# Altium project IMU module.PrjPcb
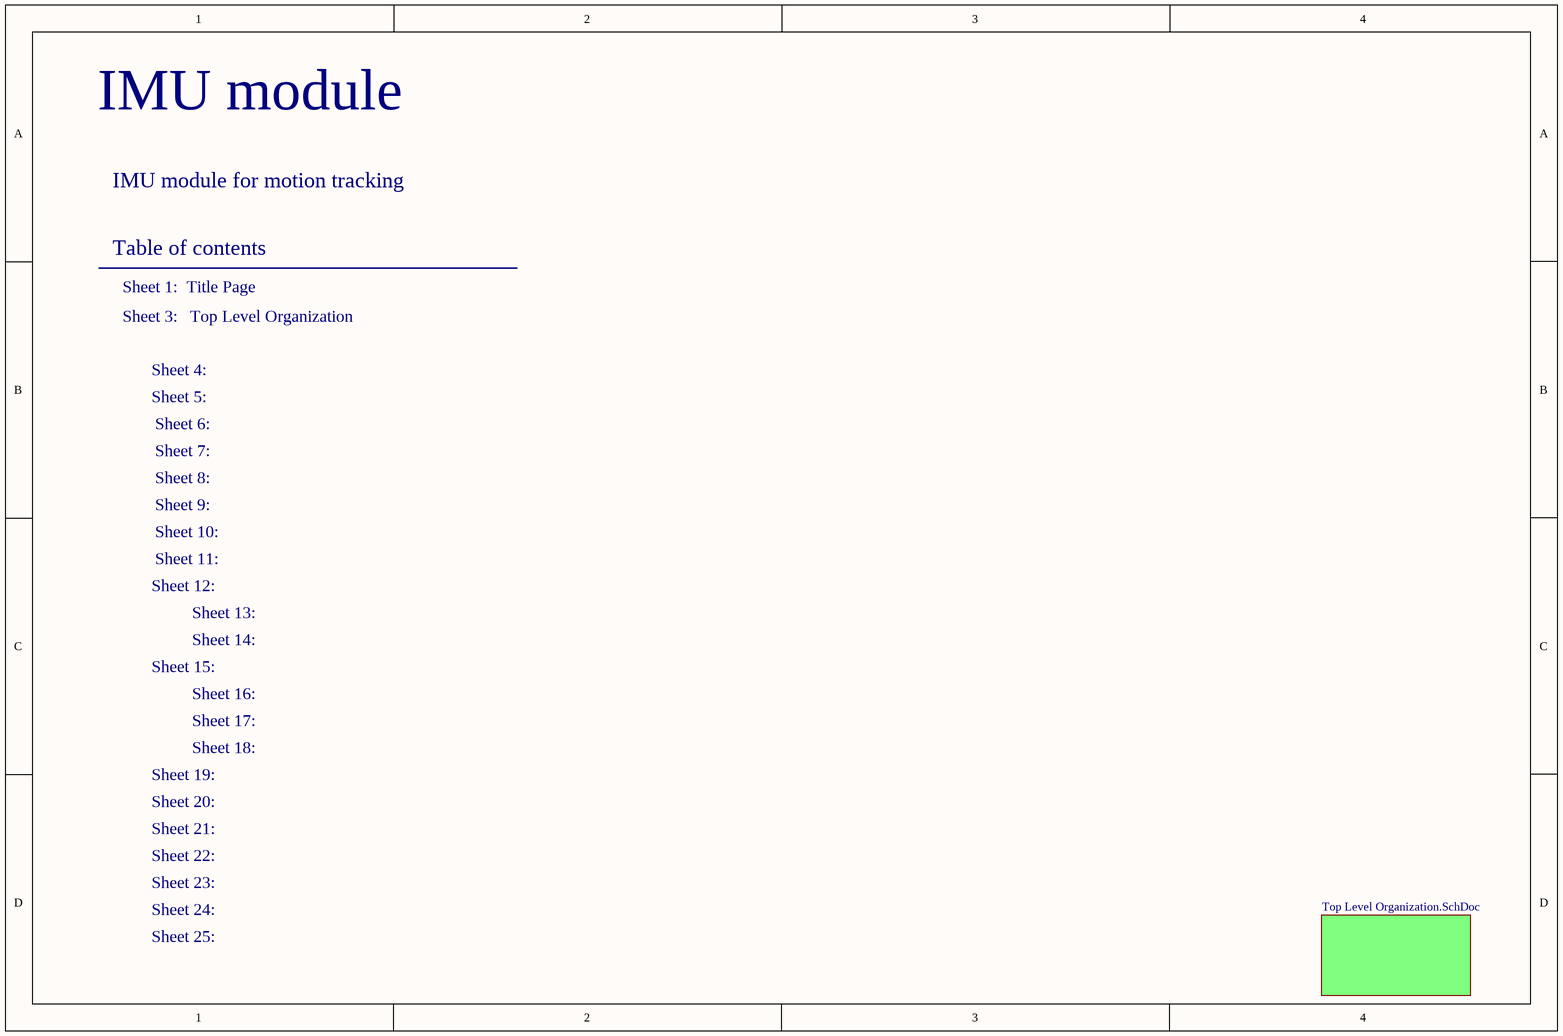
[diagram p0: Title Page.SchDoc]
1.Project Title: IMU module; 2.Title Page: Title Page; 3.Project Revision: A; 4.Drawn By: KS; 5.Description: IMU module for motion tracking; 6.Top Level Organization: Top Level Organization; 7.Title Schema 1: nRF; 8.Title Schema 2: IMU; 9.Title Schema 3: LDO; 10.Title Schema 4: BMS; 11.Title Schema 5: FUEL GAUGE; 12.Title Schema 6: MAG; 13.Title Schema 7: ANT
8 sheets, 55 parts. Net scope: flat (ports and power ports of the same name join across sheets).
Board file: PCB IMU module.PcbDoc
Sheets:
  Title Page.SchDoc
    Designator = Top Level Organization.SchDoc
      Designator = ESP.SchDoc
      Designator = IMU.SchDoc
      Designator = LDO.SchDoc
      Designator = BMS.SchDoc
      Designator = MAG.SchDoc
      Designator = CONNECTORS.SchDoc

## Sheet Title Page.SchDoc
size A4; SheetNumber: 1; SheetTotal: 1

### Sub-sheets
Designator = Top Level Organization.SchDoc: no entries

### Notes on the sheet
- Table of contents
- Sheet 1:
- Sheet 3:
- Sheet 4:
- Sheet 5:
- Sheet 6:
- Sheet 7:
- Sheet 8:
- Sheet 9:
- Sheet 10:
- Sheet 11:
- Sheet 12:
- Sheet 13:
- Sheet 14:
- Sheet 15:
- Sheet 16:
- Sheet 19:
- Sheet 17:
- Sheet 18:
- Sheet 20:
- Sheet 21:
- Sheet 22:
- Sheet 23:
- Sheet 24:
- Sheet 25:

## Sheet Top Level Organization.SchDoc
size A4; SheetNumber: 2; SheetTotal: 8
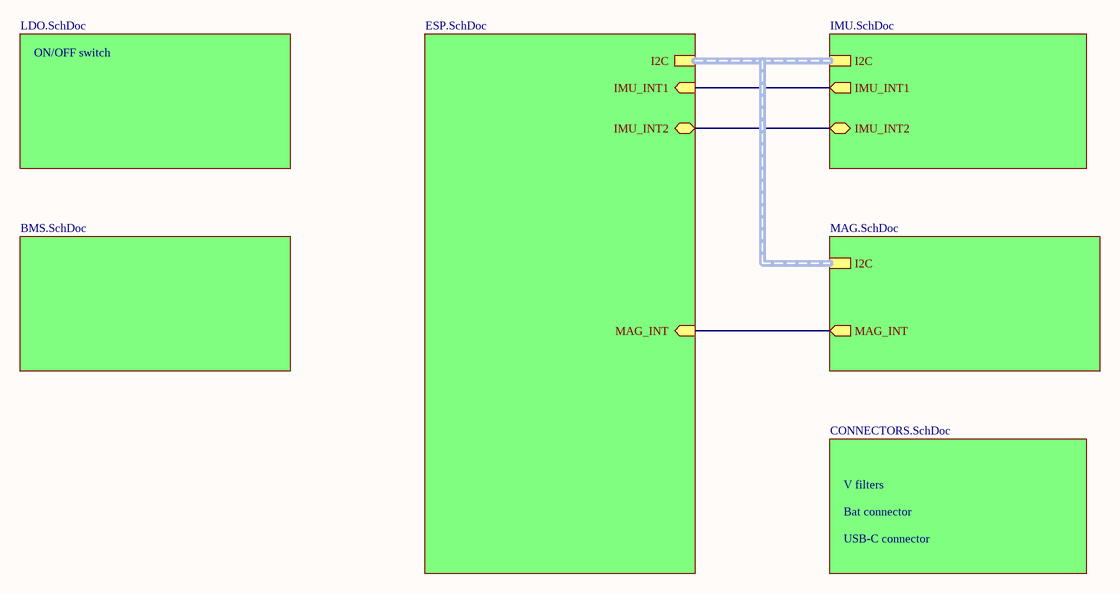
[diagram p1: Top Level Organization.SchDoc]

### Sub-sheets
Designator = ESP.SchDoc: I2C (harness SPI), MAG_INT (in), IMU_INT1 (in), IMU_INT2 (bidir)
Designator = IMU.SchDoc: I2C (harness SPI), IMU_INT1 (out), IMU_INT2 (bidir)
Designator = LDO.SchDoc: no entries
Designator = BMS.SchDoc: no entries
Designator = MAG.SchDoc: I2C (harness SPI), MAG_INT (out)
Designator = CONNECTORS.SchDoc: no entries

### Nets
(unnamed): sheet Designator/MAG_INT, sheet Designator/MAG_INT
(unnamed): sheet Designator/IMU_INT1, sheet Designator/IMU_INT1
(unnamed): sheet Designator/IMU_INT2, sheet Designator/IMU_INT2

### Notes on the sheet
- ON/OFF switch
- Bat connector
- V filters
- USB-C connector

## Sheet ESP.SchDoc
size A4; SheetNumber: 3; SheetTotal: 8
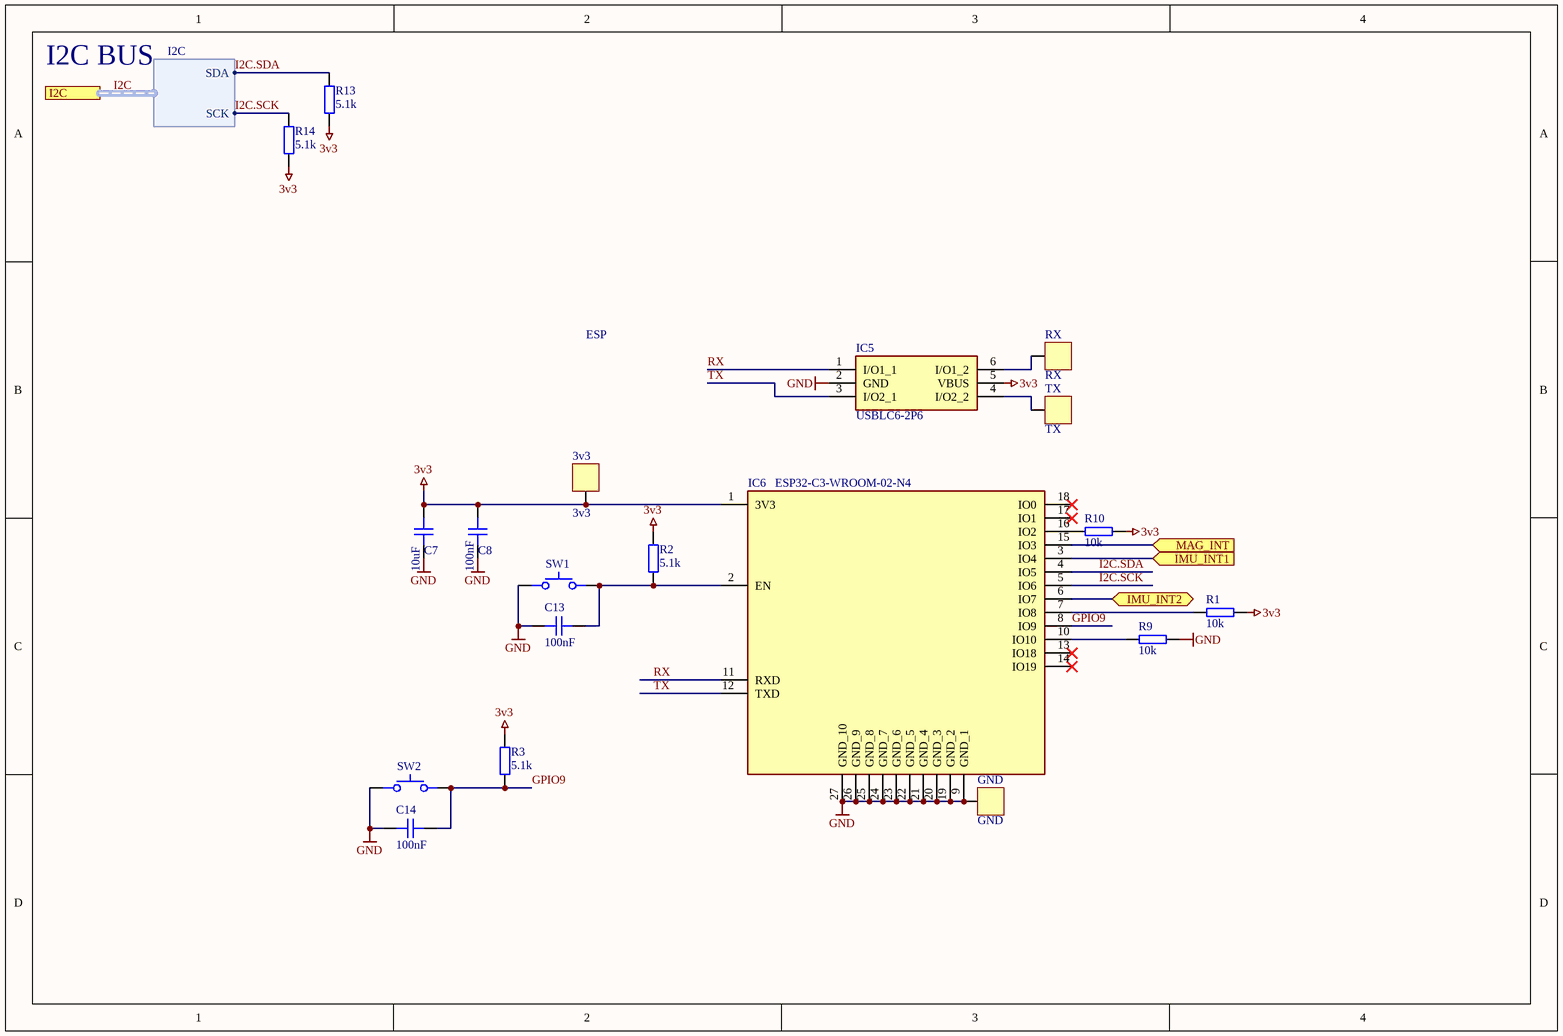
[diagram p2: ESP.SchDoc]

### Parts
3v3  3v3  [PAD_SQ_2MM]  (no BOM)
C7  value 10uF  [CAP_0402]  (hidden comment: C0402_10V)
C8  value 100nF  [CAP_0402]  (hidden comment: C0402_10V)
C13  value 100nF  [CAP_0402]  (hidden comment: C0402_10V)
C14  value 100nF  [CAP_0402]  (hidden comment: C0402_10V)
GND  GND  [PAD_SQ_2MM]  (no BOM)
IC5  USBLC6-2P6  [USBLC62P6]
IC6  ESP32-C3-WROOM-02-N4  [ESP32C3WROOM02N4]
R1  value 10k  [RES 0402/1005]  (hidden comment: Resistor)
R2  value 5.1k  [RES_0402]  (hidden comment: R0402)
R3  value 5.1k  [RES_0402]  (hidden comment: R0402)
R9  value 10k  [RES 0402/1005]  (hidden comment: Resistor)
R10  value 10k  [RES 0402/1005]  (hidden comment: Resistor)
R13  value 5.1k  [RES_0402]  (hidden comment: R0402)
R14  value 5.1k  [RES_0402]  (hidden comment: R0402)
RX  RX  [PAD_SQ_2MM]  (no BOM)
SW1  SKRPANE010  [SKRPANE010]  (value not drawn)
SW2  SKRPANE010  [SKRPANE010]  (value not drawn)
TX  TX  [PAD_SQ_2MM]  (no BOM)

### Ports
I2C (harness I2C, see Top Level Organization[3A], IMU[1A], MAG[1A]), IMU_INT1 (in, see Top Level Organization[3B], IMU[3B]), IMU_INT2 (bidir, see Top Level Organization[3B], IMU[3B]), MAG_INT (in, see Top Level Organization[3C], MAG[2B])

### Harnesses
I2C: SDA, SCK

### Nets
3v3: 3v3.1 C7.2 C8.2 IC5.5(VBUS) IC6.1(3V3) R1.2 R2.2 R3.2 R10.2 R13.2 R14.2
GND: C7.1 C8.1 C13.2 C14.2 GND.1 IC5.2(GND) IC6.9(GND_1) IC6.19(GND_2) IC6.20(GND_3) IC6.21(GND_4) IC6.22(GND_5) IC6.23(GND_6) IC6.24(GND_7) IC6.25(GND_8) IC6.26(GND_9) IC6.27(GND_10) R9.2 SW1.12 SW2.12
GPIO9: C14.1 IC6.8(IO9) R3.1 SW2.34
I2C.SCK: IC6.5(IO6) R14.1 ; port I2C.SCK
I2C.SDA: IC6.4(IO5) R13.1 ; port I2C.SDA
RX: IC5.1(I/O1_1) IC6.11(RXD)
TX: IC5.3(I/O2_1) IC6.12(TXD)
NetAC1_4: IC6.3(IO4) ; port IMU_INT1
NetAC1_9: IC6.6(IO7) ; port IMU_INT2
NetC13_1: C13.1 IC6.2(EN) R2.1 SW1.34
NetIC5_4: IC5.4(I/O2_2) TX.1
NetIC5_6: IC5.6(I/O1_2) RX.1
NetIC6_7: IC6.7(IO8) R1.1
NetIC6_10: IC6.10(IO10) R9.1
NetIC6_15: IC6.15(IO3) ; port MAG_INT
NetIC6_16: IC6.16(IO2) R10.1

Not connected (* = marked no-connect by the designer): IC6 13(IO18)* 14(IO19)* 17(IO1)* 18(IO0)*

### Buses and harness runs
harness I2C = port I2C

### Notes on the sheet
- I2C BUS
- ESP
- (in symbol ESP32-C3) ESP32; C3

### Library data of the parts
3v3 GND RX TX = PAD_SQ_2MM: Test Point Square 2mm
C7 C8 C13 C14 = CAP_0402_10V: Capacitor SMD 0402 10V
IC5 = USBLC6-2P6: Integrated Circuit; Manufacturer_Name: STMicroelectronics; Datasheet Link: https://datasheet.lcsc.com/szlcsc/STMicroelectronics-USBLC6-2P6_C15999.pdf; Height: 0.6mm; Manufacturer_Part_Number: USBLC6-2P6; Mouser Part Number: 511-USBLC6-2P6; Mouser Price/Stock: https://www.mouser.co.uk/ProductDetail/STMicroelectronics/USBLC6-2P6?qs=6ARB0lp6jlViGcbUSvj1Mw%3D%3D; Arrow Part Number: USBLC6-2P6; Arrow Price/Stock: https://www.arrow.com/en/products/usblc6-2p6/stmicroelectronics?region=nac
IC6 = ESP32-C3-WROOM-02-N4: Multiprotocol Modules SMD module, ESP32-C3, 4MB SPI flash, PCB antenna, -40 C +85 C; Part Name: ESP32-C3-WROOM-02-N4
R1 R9 R10 = CRCW040210K0JNTDBC: RES SMD 10k OHM 5% 1/16W 0402; Manufacturer: Royal Ohm; Power Rating: 63mW, 1/16W; Part Name: CRCW040210K0JNTDBC; Footprint.: 0402; Tolerance: 5%; Temperature Range: -55 ~ 155C; Manufacturer Part Number: CRCW040210K0JNTDBC; Component Link: https://www.tme.eu/pl/details/smd0402-10k/rez; Supplier: TME; Supplier Part Number: CRCW040210K0JNTDBC
R2 R3 R13 R14 = RES_0402: Resistor SMD 0402; Manufacturer: *; Manufacturer Part Number: *; Distributor Link: *
SW1 SW2 = SKRPANE010: Tactile Switch SMD SPST; Manufacturer: Alps Alpine; Manufacturer Part Number: SKRPANE010

## Sheet IMU.SchDoc
size A4; SheetNumber: 4; SheetTotal: 8
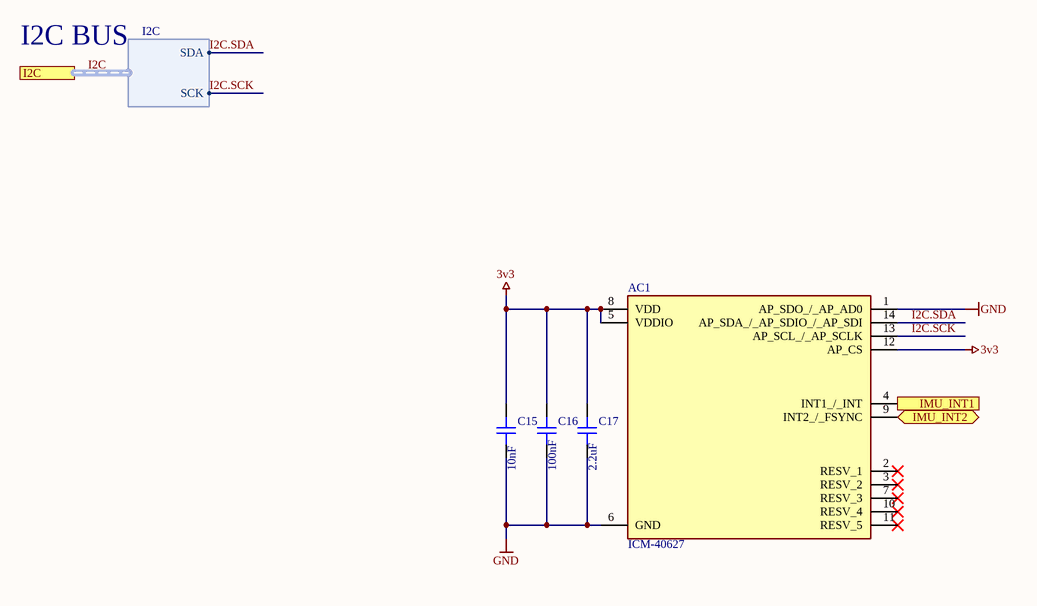
[diagram p3: IMU.SchDoc]

### Parts
AC1  ICM-40627  [ICM-40627]
C15  value 10nF  [CAP_0402]  (hidden comment: C0402_10V)
C16  value 100nF  [CAP_0402]  (hidden comment: C0402_10V)
C17  value 2.2uF  [CAP_0402]  (hidden comment: C0402_10V)

### Ports
I2C (harness I2C, see Top Level Organization[3A], ESP[1A], MAG[1A]), IMU_INT1 (out, see Top Level Organization[3B], ESP[3C]), IMU_INT2 (bidir, see Top Level Organization[3B], ESP[3C])

### Harnesses
I2C: SDA, SCK

### Nets
3v3: AC1.5(VDDIO) AC1.8(VDD) AC1.12(AP_CS) C15.2 C16.2 C17.2
GND: AC1.1(AP_SDO_/_AP_AD0) AC1.6(GND) C15.1 C16.1 C17.1
I2C.SCK: AC1.13(AP_SCL_/_AP_SCLK) ; port I2C.SCK
I2C.SDA: AC1.14(AP_SDA_/_AP_SDIO_/_AP_SDI) ; port I2C.SDA
NetAC1_4: AC1.4(INT1_/_INT) ; port IMU_INT1
NetAC1_9: AC1.9(INT2_/_FSYNC) ; port IMU_INT2

Not connected (* = marked no-connect by the designer): AC1 2(RESV_1)* 3(RESV_2)* 7(RESV_3)* 10(RESV_4)* 11(RESV_5)*

### Buses and harness runs
harness I2C = port I2C

### Notes on the sheet
- I2C BUS

### Library data of the parts
AC1 = ICM-40627: Accelerometer; Manufacturer_Name: TDK; Datasheet Link: https://3cfeqx1hf82y3xcoull08ihx-wpengine.netdna-ssl.com/wp-content/uploads/2021/04/DS-000381-ICM-40627-v1.2.pdf; Manufacturer_Part_Number: ICM-40627; Mouser Part Number: 410-ICM-40627; Mouser Price/Stock: https://www.mouser.co.uk/ProductDetail/TDK-InvenSense/ICM-40627?qs=iLbezkQI%252BsgePVjJNSY7vQ%3D%3D; Arrow Part Number: ICM-40627; Arrow Price/Stock: https://www.arrow.com/en/products/icm-40627/invensense?region=nac
C15-C17 = CAP_0402_10V: Capacitor SMD 0402 10V

## Sheet LDO.SchDoc
size A4; SheetNumber: 5; SheetTotal: 8
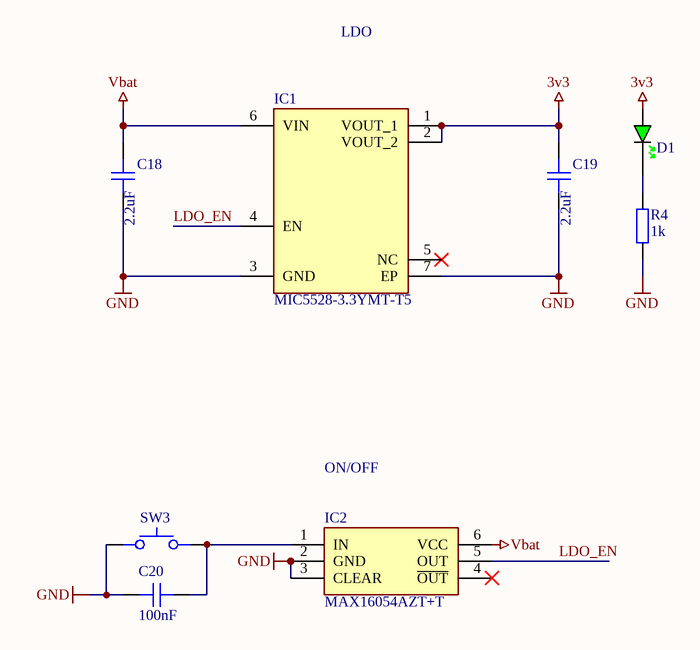
[diagram p4: LDO.SchDoc]

### Parts
C18  value 2.2uF  [CAP_0402]  (hidden comment: C0402_10V)
C19  value 2.2uF  [CAP_0402]  (hidden comment: C0402_10V)
C20  value 100nF  [CAP_0402]  (hidden comment: C0402_10V)
D1  GREEN  [LED_0402_GREEN]  (value not drawn)
IC1  MIC5528-3.3YMT-T5  [SON40P120X120X60-7N-D]
IC2  MAX16054AZT+T  [SOT95P275X110-6N]
R4  value 1k  [RES_0402]  (hidden comment: R0402)
SW3  SKRPANE010  [SKRPANE010]  (value not drawn)

### Nets
3v3: C19.2 D1.A IC1.1(VOUT_1) IC1.2(VOUT_2)
GND: C18.1 C19.1 C20.2 IC1.3(GND) IC1.7(EP) IC2.2(GND) IC2.3(CLEAR) R4.2 SW3.12
Vbat: C18.2 IC1.6(VIN) IC2.6(VCC)
LDO_EN: IC1.4(EN) IC2.5(OUT)
NetC20_1: C20.1 IC2.1(IN) SW3.34
NetD1_K: D1.K R4.1

Not connected (* = marked no-connect by the designer): IC1 5(NC)*; IC2 4(~{OUT})*

### Notes on the sheet
- LDO
- ON/OFF

### Library data of the parts
C18-C20 = CAP_0402_10V: Capacitor SMD 0402 10V
D1 = LED_0402_GREEN: LED 0402 GREEN SMD
IC1 = MIC5528-3.3YMT-T5: LDO 3v3 500mA; Manufacturer_Name: Microchip; Datasheet Link: https://nl.mouser.com/datasheet/2/268/MIC5528_High_Performance_500mA_LDO_in_Thin_and_Ext-1891284.pdf; Height: 0.6mm; Manufacturer_Part_Number: MIC5528-3.3YMT-T5; Mouser Part Number: 998-MIC5528-3.3YMTT5; Mouser Price/Stock: https://www.mouser.co.uk/ProductDetail/Microchip-Technology/MIC5528-3.3YMT-T5?qs=U6T8BxXiZAUrsVLummtswg%3D%3D; Arrow Part Number: MIC5528-3.3YMT-T5; Arrow Price/Stock: https://www.arrow.com/en/products/mic5528-3.3ymt-t5/microchip-technology?region=nac
IC2 = MAX16054AZT+T: Integrated Circuit; Manufacturer_Name: Analog Devices; Datasheet Link: https://datasheet.datasheetarchive.com/originals/distributors/SFDatasheet-4/sf-00087822.pdf; Height: 1.1mm; Manufacturer_Part_Number: MAX16054AZT+T; Mouser Part Number: 700-MAX16054AZTT; Mouser Price/Stock: https://www.mouser.co.uk/ProductDetail/Analog-Devices-Maxim-Integrated/MAX16054AZT%2bT?qs=CDqwynd4ZNoG75aAAjGoqQ%3D%3D; Arrow Part Number: MAX16054AZT+T; Arrow Price/Stock: https://www.arrow.com/en/products/max16054aztt/maxim-integrated?region=nac
R4 = RES_0402: Resistor SMD 0402; Manufacturer: *; Manufacturer Part Number: *; Distributor Link: *
SW3 = SKRPANE010: as SW1 on sheet ESP; Manufacturer Part Number: SKRPANE010

## Sheet BMS.SchDoc
size A4; SheetNumber: 6; SheetTotal: 8
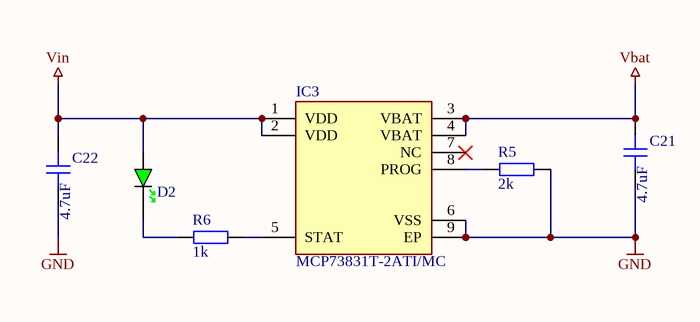
[diagram p5: BMS.SchDoc]

### Parts
C21  value 4.7uF  [CAP_0402]  (hidden comment: C0402_10V)
C22  value 4.7uF  [CAP_0402]  (hidden comment: C0402_10V)
D2  GREEN  [LED_0402_GREEN]  (value not drawn)
IC3  MCP73831T-2ATI/MC  [SON65P300X300X80-9N-D]
R5  value 2k  [RES_0402]  (hidden comment: R0402)
R6  value 1k  [RES_0402]  (hidden comment: R0402)

### Nets
GND: C21.1 C22.1 IC3.6(VSS) IC3.9(EP) R5.2
Vbat: C21.2 IC3.3(VBAT) IC3.4(VBAT)
Vin: C22.2 D2.A IC3.1(VDD) IC3.2(VDD)
NetD2_K: D2.K R6.1
NetIC3_5: IC3.5(STAT) R6.2
NetIC3_8: IC3.8(PROG) R5.1

Not connected (* = marked no-connect by the designer): IC3 7(NC)*

### Library data of the parts
C21 C22 = CAP_0402_10V: Capacitor SMD 0402 10V
D2 = LED_0402_GREEN: LED 0402 GREEN SMD
IC3 = MCP73831T-2ATI/MC: Battery Management Charge mgnt contr; Manufacturer_Name: Microchip; Datasheet Link: https://www.mouser.pl/datasheet/2/268/20001984g-846362.pdf; Manufacturer_Part_Number: MCP73831T-2ATI/MC; Mouser Part Number: 579-MCP73831T-2ATIMC
R5 R6 = RES_0402: Resistor SMD 0402; Manufacturer: *; Manufacturer Part Number: *; Distributor Link: *

## Sheet MAG.SchDoc
size A4; SheetNumber: 7; SheetTotal: 8
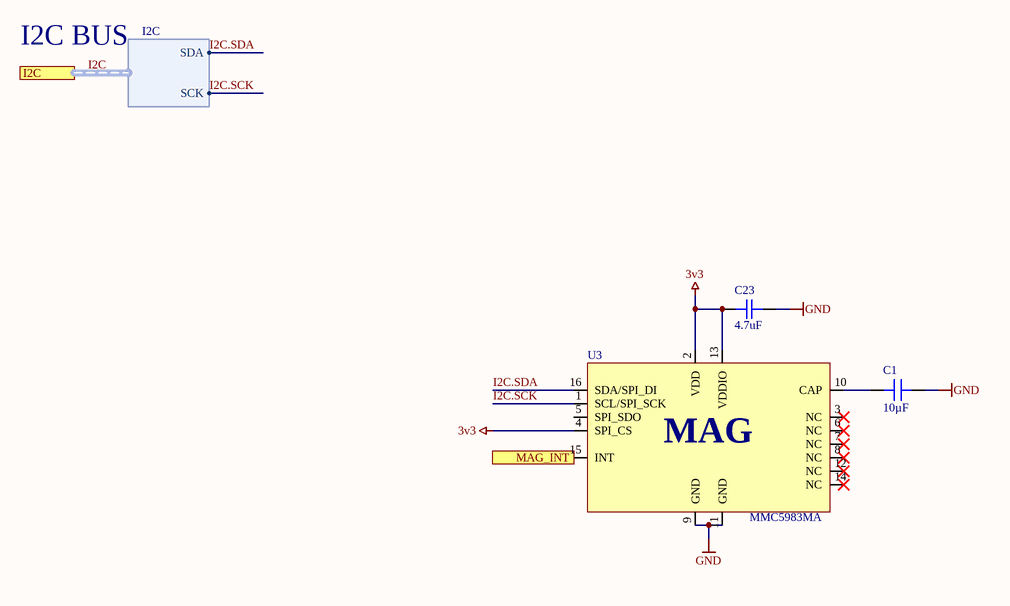
[diagram p6: MAG.SchDoc]

### Parts
C1  value 10µF  [CAP 0603/1608]  (hidden comment: Ceramic_Capacitor)
C23  value 4.7uF  [CAP_0402]  (hidden comment: C0402_10V)
U3  MMC5983MA  [MMC5983MA-LGA]

### Ports
I2C (harness I2C, see Top Level Organization[3B], ESP[1A], IMU[1A]), MAG_INT (out, see Top Level Organization[3C], ESP[3C])

### Harnesses
I2C: SDA, SCK

### Nets
3v3: C23.2 U3.2(VDD) U3.4(SPI_CS) U3.13(VDDIO)
GND: C1.2 C23.1 U3.9(GND) U3.11(GND)
I2C.SCK: U3.1(SCL/SPI_SCK) ; port I2C.SCK
I2C.SDA: U3.16(SDA/SPI_DI) ; port I2C.SDA
NetC1_1: C1.1 U3.10(CAP)
NetIC6_15: U3.15(INT) ; port MAG_INT

Not connected (* = marked no-connect by the designer): U3 3(NC)* 5(SPI_SDO) 6(NC)* 7(NC)* 8(NC)* 12(NC)* 14(NC)*

### Buses and harness runs
harness I2C = port I2C

### Notes on the sheet
- I2C BUS
- (in symbol MMC5983MA) MAG

### Library data of the parts
C1 = 0603ZD106MAT2A: CAP CER 10UF 10V X5R 20% 0603; Manufacturer: AVX; Part Name: 0603ZD106MAT2A; Type: Ceramic; Footprint.: 0603; Tolerance: 20%; Temperature Range: -55 ~ 125C; Voltage: 10V; Dielectric: X5R; Manufacturer Part Number: 0603ZD106MAT2A; Component Link: https://www.tme.eu/pl/details/0603zd106mat2a/; Supplier: TME; Supplier Part Number: 0603ZD106MAT2A
C23 = CAP_0402_10V: Capacitor SMD 0402 10V
U3 = MMC5983MA: ±8 Gauss, High Performance 3-axis Magnetic Sensor I2C/SPI; Manufacturer: MEMSIC; Manufacturer Part Number: MMC5983MA

## Sheet CONNECTORS.SchDoc
size A4; SheetNumber: 8; SheetTotal: 8
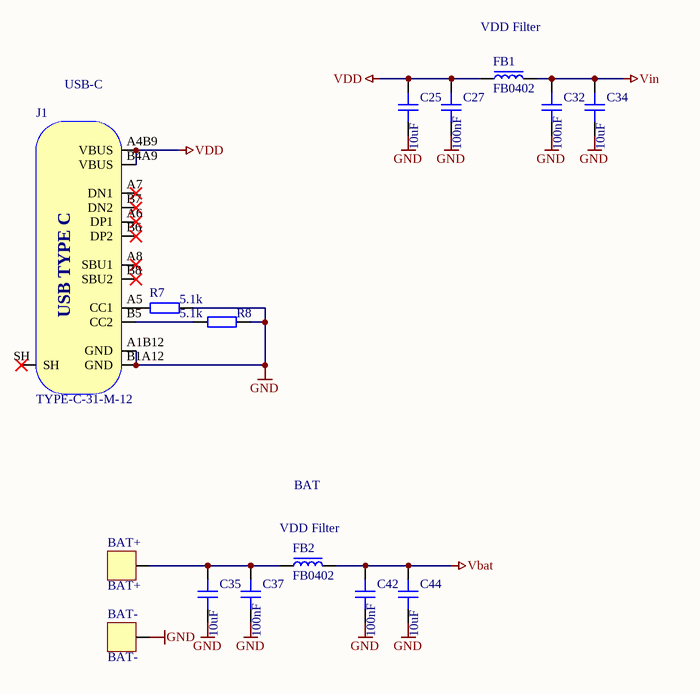
[diagram p7: CONNECTORS.SchDoc]

### Parts
BAT+  BAT+  [PAD_SQ_2MM]  (no BOM)
BAT-  BAT-  [PAD_SQ_2MM]  (no BOM)
C25  value 10uF  [CAP_0402]  (hidden comment: C0402_10V)
C27  value 100nF  [CAP_0402]  (hidden comment: C0402_10V)
C32  value 100nF  [CAP_0402]  (hidden comment: C0402_10V)
C34  value 10uF  [CAP_0402]  (hidden comment: C0402_10V)
C35  value 10uF  [CAP_0402]  (hidden comment: C0402_10V)
C37  value 100nF  [CAP_0402]  (hidden comment: C0402_10V)
C42  value 100nF  [CAP_0402]  (hidden comment: C0402_10V)
C44  value 10uF  [CAP_0402]  (hidden comment: C0402_10V)
FB1  FB0402  [FB_0402]
FB2  FB0402  [FB_0402]
J1  TYPE-C-31-M-12  [TYPE-C-31-M-12]
R7  value 5.1k  [RES_0402]  (hidden comment: R0402)
R8  value 5.1k  [RES_0402]  (hidden comment: R0402)

### Nets
GND: BAT-.1 C25.1 C27.1 C32.1 C34.1 C35.1 C37.1 C42.1 C44.1 J1.A1B12(GND) J1.B1A12(GND) R7.2 R8.2
Vbat: C42.2 C44.2 FB2.2
VDD: C25.2 C27.2 FB1.1 J1.A4B9(VBUS) J1.B4A9(VBUS)
Vin: C32.2 C34.2 FB1.2
NetBAT+_1: BAT+.1 C35.2 C37.2 FB2.1
NetJ1_A5: J1.A5(CC1) R7.1
NetJ1_B5: J1.B5(CC2) R8.1

Not connected (* = marked no-connect by the designer): J1 A6(DP1)* A7(DN1)* A8(SBU1)* B6(DP2)* B7(DN2)* B8(SBU2)* SH*

### Notes on the sheet
- VDD Filter
- USB-C
- BAT
- (near FB2) VDD Filter
- (in symbol TYPE-C-31-M-12) USB TYPE C

### Library data of the parts
BAT+ BAT- = PAD_SQ_2MM: Test Point Square 2mm
C25 C27 C32 C34 C35 C37 C42 C44 = CAP_0402_10V: Capacitor SMD 0402 10V
FB1 FB2 = FB_0402: Ferrite Bead SMD 0402
J1 = TYPE-C-31-M-12: USB Type C Connector Horizontal SMT; Manufacturer: Koren Hroparts; Manufacturer Part Number: TYPE-C-31-M-12
R7 R8 = RES_0402: Resistor SMD 0402; Manufacturer: *; Manufacturer Part Number: *; Distributor Link: *

## Nets that join several sheets
3v3: ESP (11 pins), IMU (6 pins), LDO (C19.2 D1.A IC1.1 IC1.2), MAG (C23.2 U3.2 U3.4 U3.13)
GND: ESP (19 pins), IMU (5 pins), LDO (9 pins), BMS (5 pins), MAG (C1.2 C23.1 U3.9 U3.11), CONNECTORS (13 pins)
Vbat: LDO (C18.2 IC1.6 IC2.6), BMS (C21.2 IC3.3 IC3.4), CONNECTORS (C42.2 C44.2 FB2.2)
Vin: BMS (C22.2 D2.A IC3.1 IC3.2), CONNECTORS (C32.2 C34.2 FB1.2)
I2C.SCK: ESP (IC6.5 R14.1), IMU (AC1.13), MAG (U3.1)
I2C.SDA: ESP (IC6.4 R13.1), IMU (AC1.14), MAG (U3.16)
NetAC1_4: ESP (IC6.3), IMU (AC1.4)
NetAC1_9: ESP (IC6.6), IMU (AC1.9)
NetIC6_15: ESP (IC6.15), MAG (U3.15)